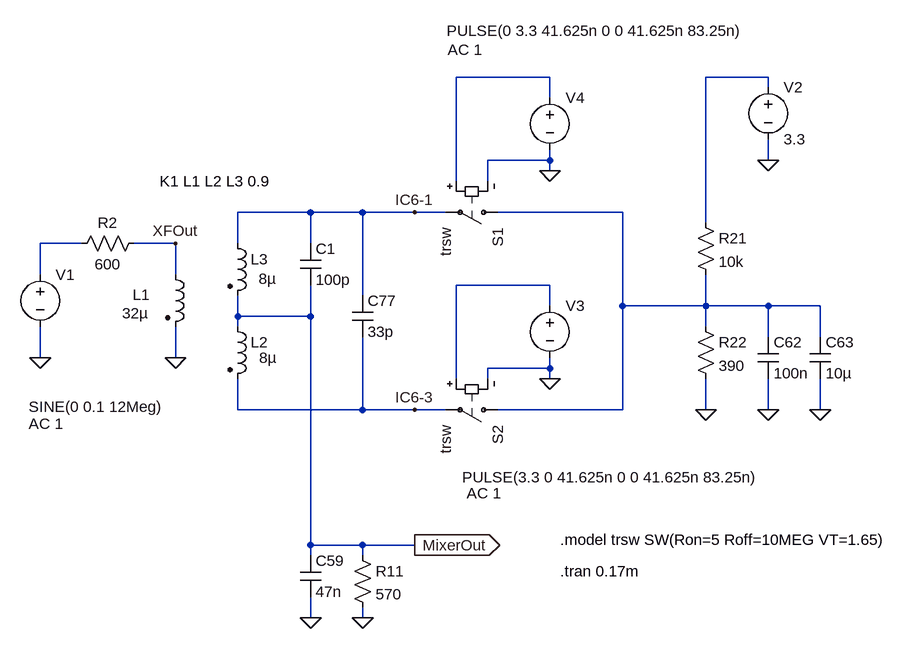
[diagram p0: schematic T2Mixer.asc]
T2Mixer.asc, the LTspice schematic file:
Version 4
SHEET 1 1264 680
WIRE 704 -192 560 -192
WIRE 1040 -192 944 -192
WIRE 1040 -176 1040 -192
WIRE 704 -160 704 -192
WIRE 704 -64 704 -80
WIRE 704 -64 608 -64
WIRE 1040 -64 1040 -96
WIRE 704 -48 704 -64
WIRE 560 -32 560 -192
WIRE 608 -32 608 -64
WIRE 336 16 224 16
WIRE 416 16 336 16
WIRE 496 16 416 16
WIRE 544 16 496 16
WIRE 816 16 624 16
WIRE 944 32 944 -192
WIRE -16 64 -80 64
WIRE 128 64 64 64
WIRE 224 64 224 16
WIRE 336 64 336 16
WIRE -80 112 -80 64
WIRE 128 112 128 64
WIRE 704 128 560 128
WIRE 416 144 416 16
WIRE 704 160 704 128
WIRE 816 160 816 16
WIRE 944 160 944 112
WIRE 944 160 816 160
WIRE 1040 160 944 160
WIRE 1120 160 1040 160
WIRE 224 176 224 144
WIRE 336 176 336 128
WIRE 336 176 224 176
WIRE 224 192 224 176
WIRE 944 192 944 160
WIRE 1040 208 1040 160
WIRE 1120 208 1120 160
WIRE -80 240 -80 192
WIRE 128 240 128 192
WIRE 704 256 704 240
WIRE 704 256 608 256
WIRE 560 272 560 128
WIRE 608 272 608 256
WIRE 704 272 704 256
WIRE 224 320 224 272
WIRE 416 320 416 208
WIRE 416 320 224 320
WIRE 496 320 416 320
WIRE 544 320 496 320
WIRE 816 320 816 160
WIRE 816 320 624 320
WIRE 944 320 944 272
WIRE 1040 320 1040 272
WIRE 1120 320 1120 272
WIRE 336 528 336 176
WIRE 416 528 336 528
WIRE 496 528 416 528
WIRE 336 544 336 528
WIRE 416 544 416 528
WIRE 336 640 336 608
WIRE 416 640 416 624
FLAG 336 640 0
FLAG 416 640 0
FLAG 128 240 0
FLAG -80 240 0
FLAG 1040 -64 0
FLAG 944 320 0
FLAG 1040 320 0
FLAG 1120 320 0
FLAG 704 -48 0
FLAG 704 272 0
FLAG 496 528 MixerOut
IOPIN 496 528 Out
FLAG 128 64 XFOut
FLAG 496 16 IC6-1
FLAG 496 320 IC6-3
SYMBOL ind2 112 96 R0
WINDOW 3 -66 75 Left 2
WINDOW 0 -50 47 Left 2
SYMATTR Value 32µ
SYMATTR InstName L1
SYMATTR SpiceLine Rser=1 Rpar=10k
SYMBOL ind2 208 176 R0
WINDOW 3 49 64 Left 2
SYMATTR Value 8µ
SYMATTR InstName L2
SYMATTR SpiceLine Rser=1 Rpar=10k
SYMBOL ind2 208 48 R0
WINDOW 3 48 70 Left 2
SYMATTR Value 8µ
SYMATTR InstName L3
SYMATTR SpiceLine Rser=1 Rpar=10k
SYMBOL sw 640 16 R90
SYMATTR InstName S1
SYMATTR Value trsw
SYMBOL sw 640 320 R90
SYMATTR InstName S2
SYMATTR Value trsw
SYMBOL res 400 528 R0
SYMATTR InstName R11
SYMATTR Value 570
SYMBOL cap 320 544 R0
SYMATTR InstName C59
SYMATTR Value 47n
SYMBOL res 80 48 R90
WINDOW 0 0 56 VBottom 2
WINDOW 3 32 56 VTop 2
SYMATTR InstName R2
SYMATTR Value 600
SYMBOL voltage -80 96 R0
WINDOW 3 -18 219 Left 2
WINDOW 123 -18 245 Left 2
WINDOW 39 0 0 Left 0
SYMATTR Value SINE(0 0.1 12Meg)
SYMATTR Value2 AC 1
SYMATTR InstName V1
SYMBOL res 928 176 R0
SYMATTR InstName R22
SYMATTR Value 390
SYMBOL res 928 16 R0
SYMATTR InstName R21
SYMATTR Value 10k
SYMBOL voltage 1040 -192 R0
WINDOW 123 0 0 Left 0
WINDOW 39 0 0 Left 0
SYMATTR InstName V2
SYMATTR Value 3.3
SYMBOL cap 1024 208 R0
SYMATTR InstName C62
SYMATTR Value 100n
SYMBOL cap 1104 208 R0
SYMATTR InstName C63
SYMATTR Value 10µ
SYMBOL voltage 704 144 R0
WINDOW 3 -135 280 Left 2
WINDOW 123 -128 304 Left 2
WINDOW 39 0 0 Left 0
SYMATTR Value PULSE(3.3 0 41.625n 0 0 41.625n 83.25n)
SYMATTR Value2 AC 1
SYMATTR InstName V3
SYMBOL voltage 704 -176 R0
WINDOW 3 -159 -87 Left 2
WINDOW 123 -157 -58 Left 2
WINDOW 39 0 0 Left 0
SYMATTR Value PULSE(0 3.3 41.625n 0 0 41.625n 83.25n)
SYMATTR Value2 AC 1
SYMATTR InstName V4
SYMBOL cap 320 64 R0
SYMATTR InstName C1
SYMATTR Value 100p
SYMBOL cap 400 144 R0
SYMATTR InstName C77
SYMATTR Value 33p
TEXT 104 -32 Left 2 !K1 L1 L2 L3 0.9
TEXT 720 520 Left 2 !.model trsw SW(Ron=5 Roff=10MEG VT=1.65)
TEXT 720 568 Left 2 !.tran 0.17m

The netlist it stands for:
* T2Mixer.asc
L1 XFOut 0 32µ Rser=1 Rpar=10k
L2 MixerOut IC6-3 8µ Rser=1 Rpar=10k
L3 IC6-1 MixerOut 8µ Rser=1 Rpar=10k
S1 N003 IC6-1 N001 0 trsw
S2 N003 IC6-3 N005 0 trsw
R11 MixerOut 0 570
C59 MixerOut 0 47n
R2 XFOut N004 600
V1 N004 0 SINE(0 0.1 12Meg) AC 1
R22 N003 0 390
R21 N002 N003 10k
V2 N002 0 3.3
C62 N003 0 100n
C63 N003 0 10µ
V3 N005 0 PULSE(3.3 0 41.625n 0 0 41.625n 83.25n) AC 1
V4 N001 0 PULSE(0 3.3 41.625n 0 0 41.625n 83.25n) AC 1
C1 IC6-1 MixerOut 100p
C77 IC6-1 IC6-3 33p
K1 L1 L2 L3 0.9
.model trsw SW(Ron=5 Roff=10MEG VT=1.65)
.tran 0.17m
.backanno
.end